# EAGLE design Tilt-NE555-C (EAGLE 6.4)
Circuito per prelevare gli impulsi provenienti da un tilt e creare impulsi di lunghezza determinata
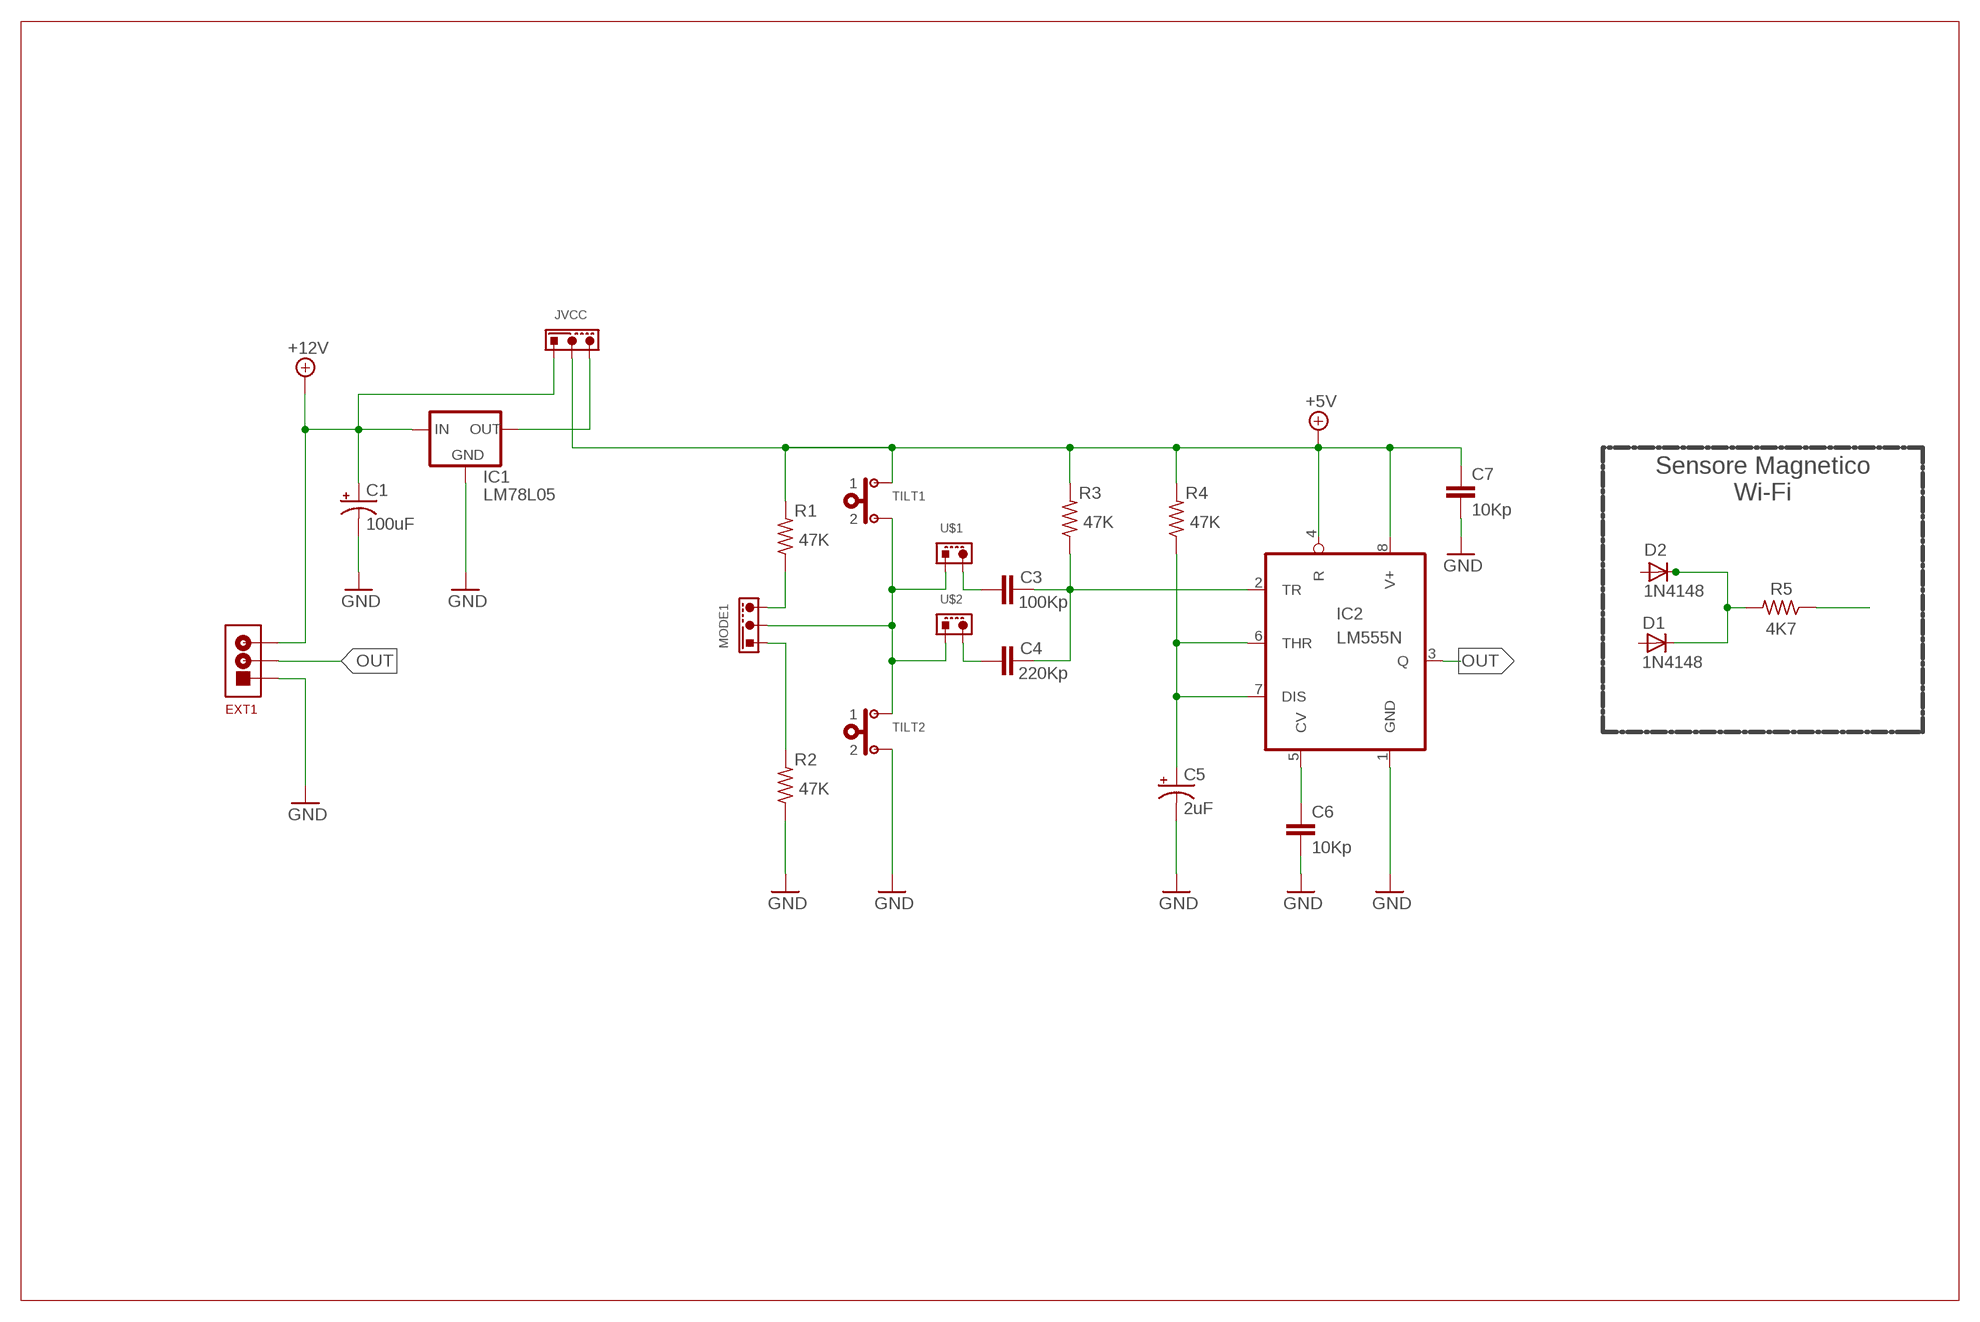
[diagram p0: schematic, sheet 1]

## Parts
C1  100uF  CPOL-USE5-5  [E5-5]
C3  100Kp  C-EU075-032X103  [C075-032X103]
C4  220Kp  C-EU050-035X075  [C050-035X075]
C5  2uF  CPOL-USE5-5  [E5-5]
C6  10Kp  C-EU050-035X075  [C050-035X075]
C7  10Kp  C-EU050-035X075  [C050-035X075]
D1  1N4148  1N4148DO35-10  [DO35-10]
D2  1N4148  1N4148DO35-10  [DO35-10]
EXT1  MAMMUTH03  [MAMMUTH03]
IC1  LM78L05  78LXX  [78LXX]
IC2  LM555N  [DIL08]
JVCC  JUMPER3  [SIP03]
MODE1  JUMPER3  [SIP03]
R1  47K  R-US_0207/15  [0207/15]
R2  47K  R-US_0207/15  [0207/15]
R3  47K  R-US_0207/15  [0207/15]
R4  47K  R-US_0207/15  [0207/15]
R5  4K7  R-US_0207/12  [0207/12]
TILT1  PULSANTENO  [SIP02]
TILT2  PULSANTENO  [SIP02]
U$1  JUMPER2X1  [SIP02]
U$2  JUMPER2X1  [SIP02]

## Nets
+5V: C7.1 IC2.4(R) IC2.8(V+) JVCC.1 R1.2 R3.2 R4.2 TILT1.1
+12V: C1.+ EXT1.P$3 IC1.IN JVCC.2
GND: C1.- C5.- C6.2 C7.2 EXT1.P$1 IC1.GND IC2.1(GND) R2.1 TILT2.2
N$1: C3.2 C4.2 IC2.2(TR) R3.1
N$2: MODE1.1 TILT1.2 TILT2.1 U$1.1 U$2.1
N$3: C5.+ IC2.6(THR) IC2.7(DIS) R4.1
N$4: C6.1 IC2.5(CV)
N$5: MODE1.2 R2.2
N$6: D1.C D2.C R5.2
N$8: IC1.OUT JVCC.3
N$9: C4.1 U$2.2
N$10: C3.1 U$1.2
N$13: MODE1.3 R1.1
OUT: EXT1.P$2 IC2.3(Q)
SENSORE: R5.1
Unconnected: D1.A D2.A

## Notes on the sheet
- Sensore Magnetico
  Wi-Fi

## Library data of the parts
C1 C5 = Ln-RCL:CPOL-US: POLARIZED CAPACITOR, American symbol
C3 C4 C6 C7 = rcl:C-EU: CAPACITOR, European symbol
D1 D2 = diode:1N4148: DIODE high speed (Philips)
EXT1 = Ln-Varie:MAMMUTH03: Mammuth 03
IC1 = Ln-v-reg:78LXX: VOLTAGE REGULATOR
IC2 = Ln-linear:*555: TIMER
JVCC MODE1 = Ln-Varie:JUMPER3
R1-R5 = rcl:R-US_: RESISTOR, American symbol
TILT1 TILT2 = Ln-Varie:PULSANTENO: Pulsante NO
U$1 U$2 = Ln-Varie:JUMPER2X1

## Board
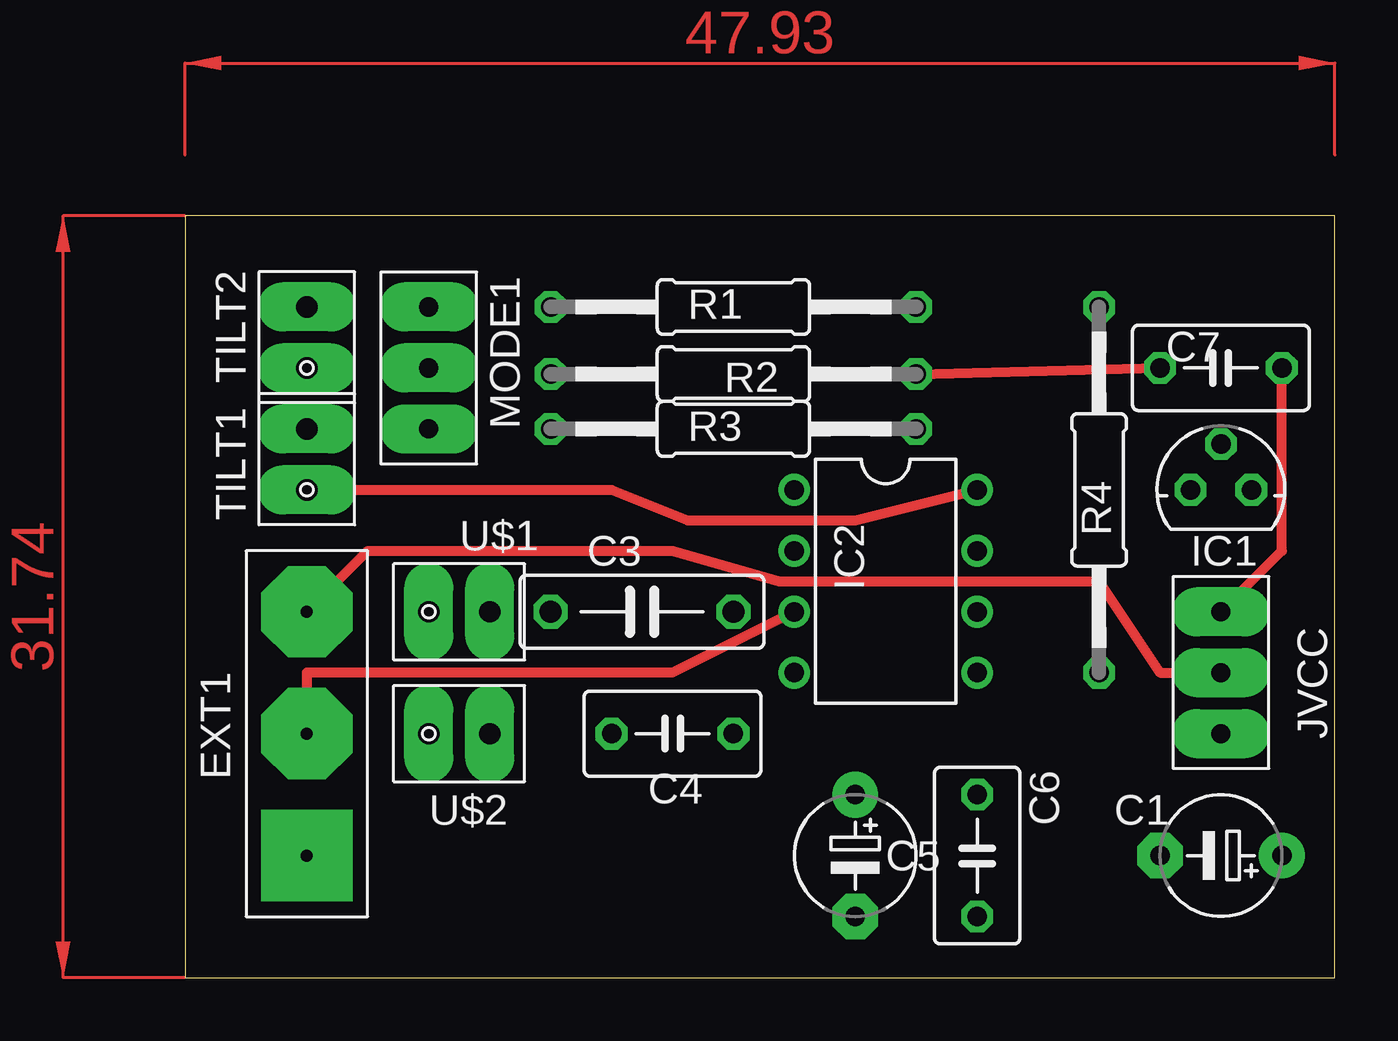
[diagram p1: board, top side]
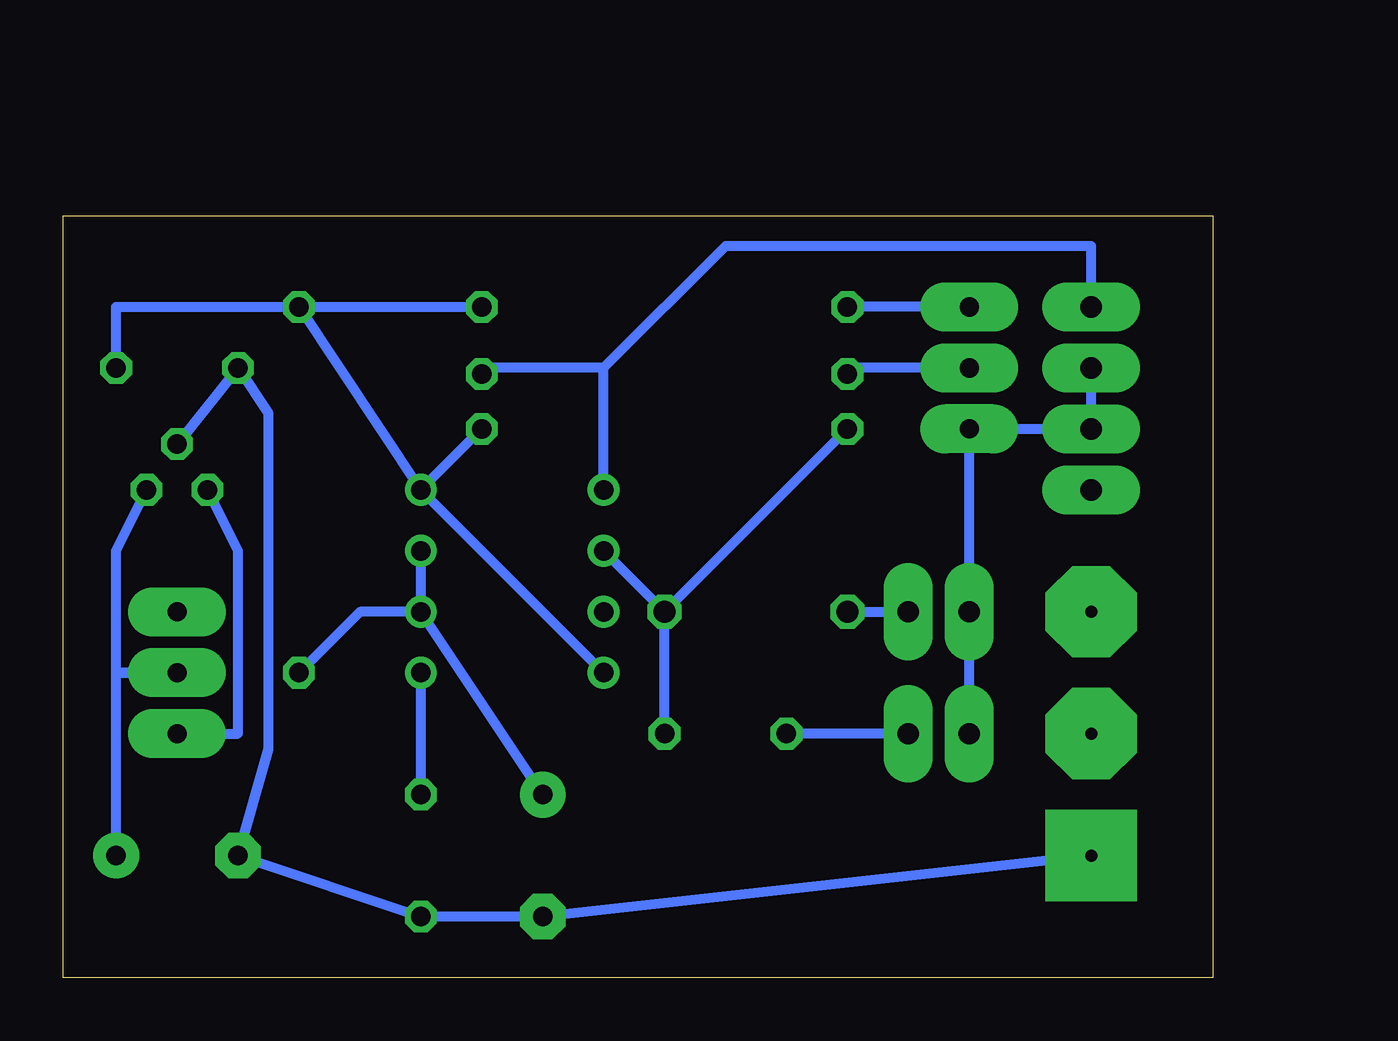
[diagram p2: board, bottom side, seen from below]

Size 47.93 x 31.74 mm. Coordinates in mm from the lower left corner, seen from the top.
Outline: 0,0 47.93,0 47.93,31.74 0,31.74 0,0
Copper layers (1*16): Top 0.035mm / dielectric 1.5mm / Bottom 0.035mm
Design rules "default": minimum track width 10mil, minimum drill 24mil, track to track 8mil, track to pad 8mil, pad to pad 8mil, via to via 8mil, smd to smd 8mil, copper to edge 40mil, drill to drill 8mil, minimum pad ring 10mil, minimum via ring 8mil, stop-mask expansion 4mil, vias tented up to drill 0mil, thermal gap 10mil

### Footprints (pad centres in the part's own frame; a part is rotated, then mirrored left to right if it is on the bottom)
E5-5 = drill 0.813 pad 1.905: + -2.54,0 | drill 0.813 pad 1.905 octagon: - 2.54,0
C075-032X103 = drill 0.914 octagon: 1 -3.81,0; 2 3.81,0
C050-035X075 = drill 0.813 octagon: 1 -2.54,0; 2 2.54,0
DO35-10 = drill 0.813 long: A 5.08,0; C -5.08,0
MAMMUTH03 = drill 0.5 pad 3.81 square: P$1 0,-5.08 | drill 0.5 pad 3.81 octagon: P$2 0,0; P$3 0,5.08
78LXX = drill 0.813 octagon: GND 0,1.905; IN 1.27,0; OUT -1.27,0
DIL08 = drill 0.813 pad 1.27: 1 -3.81,-3.81; 2 -1.27,-3.81; 3 1.27,-3.81; 4 3.81,-3.81; 5 3.81,3.81; 6 1.27,3.81; 7 -1.27,3.81; 8 -3.81,3.81
SIP03 = drill 0.8 pad 2.032 long: 1 0,0; 2 0,2.54; 3 0,5.08
0207/15 = drill 0.813 octagon: 1 -7.62,0; 2 7.62,0
0207/12 = drill 0.813 octagon: 1 -6.35,0; 2 6.35,0
SIP02 = drill 0.889 pad 2.032 long: 1 0,1.27; 2 0,-1.27

### Placement (x,y rotation side)
C1  43.18,5.08 180 top
C3  19.05,15.24 0 top
C4  20.32,10.16 0 top
C5  27.94,5.08 270 top
C6  33.02,5.08 270 top
C7  43.18,25.4 180 top
D1  40.64,-5.08 180 top  (outside the outline)
D2  25.4,-5.08 180 top  (outside the outline)
EXT1  5.08,10.16 0 top
IC1  43.18,20.32 0 top
IC2  29.21,16.51 270 top
JVCC  43.18,15.24 180 top
MODE1  10.16,22.86 0 top
R1  22.86,27.94 0 top
R2  22.86,25.15 180 top
R3  22.86,22.86 0 top
R4  38.1,20.32 90 top
R5  8.89,-5.08 180 top  (outside the outline)
TILT1  5.08,21.59 180 top
TILT2  5.08,26.67 180 top
U$1  11.43,15.24 90 top
U$2  11.43,10.16 90 top

### Tracks (layer width: path | path; a pad name or v marks a point on that pad's centre or on a via)
+5V
  Top 0.406: JVCC.1 45.72,17.78 C7.1 | TILT1.1 17.78,20.32 20.95,19.05 27.94,19.05 IC2.8
  Bottom 0.406: IC2.4 IC2.8 | IC2.8 R3.2 | R4.2 R1.2 | R4.2 IC2.8 | C7.1 45.72,27.94 R4.2
+12V
  Top 0.406: EXT1.P$3 7.62,17.78 20.32,17.78 24.77,16.51 38.1,16.51 40.64,12.7 JVCC.2
  Bottom 0.406: C1.+ 45.72,12.7 | 45.72,12.7 JVCC.2 45.72,12.7 | 45.72,12.7 45.72,17.78 IC1.IN
GND
  Top 0.406: R2.1 C7.2
  Bottom 0.406: IC2.1 25.4,25.4 | 25.4,25.4 30.48,25.4 R2.1 | TILT2.2 5.08,30.48 20.32,30.48 25.4,25.4 | IC1.GND C7.2 39.37,23.49 39.37,9.52 C1.- C6.2 C5.- EXT1.P$1
N$1
  Bottom 0.406: C4.2 C3.2 | R3.1 C3.2 | IC2.2 C3.2
N$2
  Bottom 0.406: TILT2.1 TILT1.2 MODE1.1 U$1.1 U$2.1
N$3
  Bottom 0.406: C5.+ IC2.6 | IC2.7 IC2.6 | IC2.6 35.56,15.24 R4.1
N$4
  Bottom 0.406: IC2.5 C6.1
N$5
  Bottom 0.406: MODE1.2 14.99,25.4 R2.2
N$6  (2 unrouted)
N$8
  Bottom 0.406: JVCC.3 40.64,10.16 40.64,17.78 IC1.OUT
N$9
  Bottom 0.406: U$2.2 C4.1
N$10
  Bottom 0.406: C3.1 U$1.2
N$13
  Bottom 0.406: MODE1.3 R1.1
OUT
  Top 0.406: IC2.3 20.32,12.7 5.08,12.7 EXT1.P$2
(copper drawn outside any net)
  shapes: Top area x2